# EAGLE design AST-WiFi-Shield (EAGLE 9.1.1)

## Sheet 1 of 2
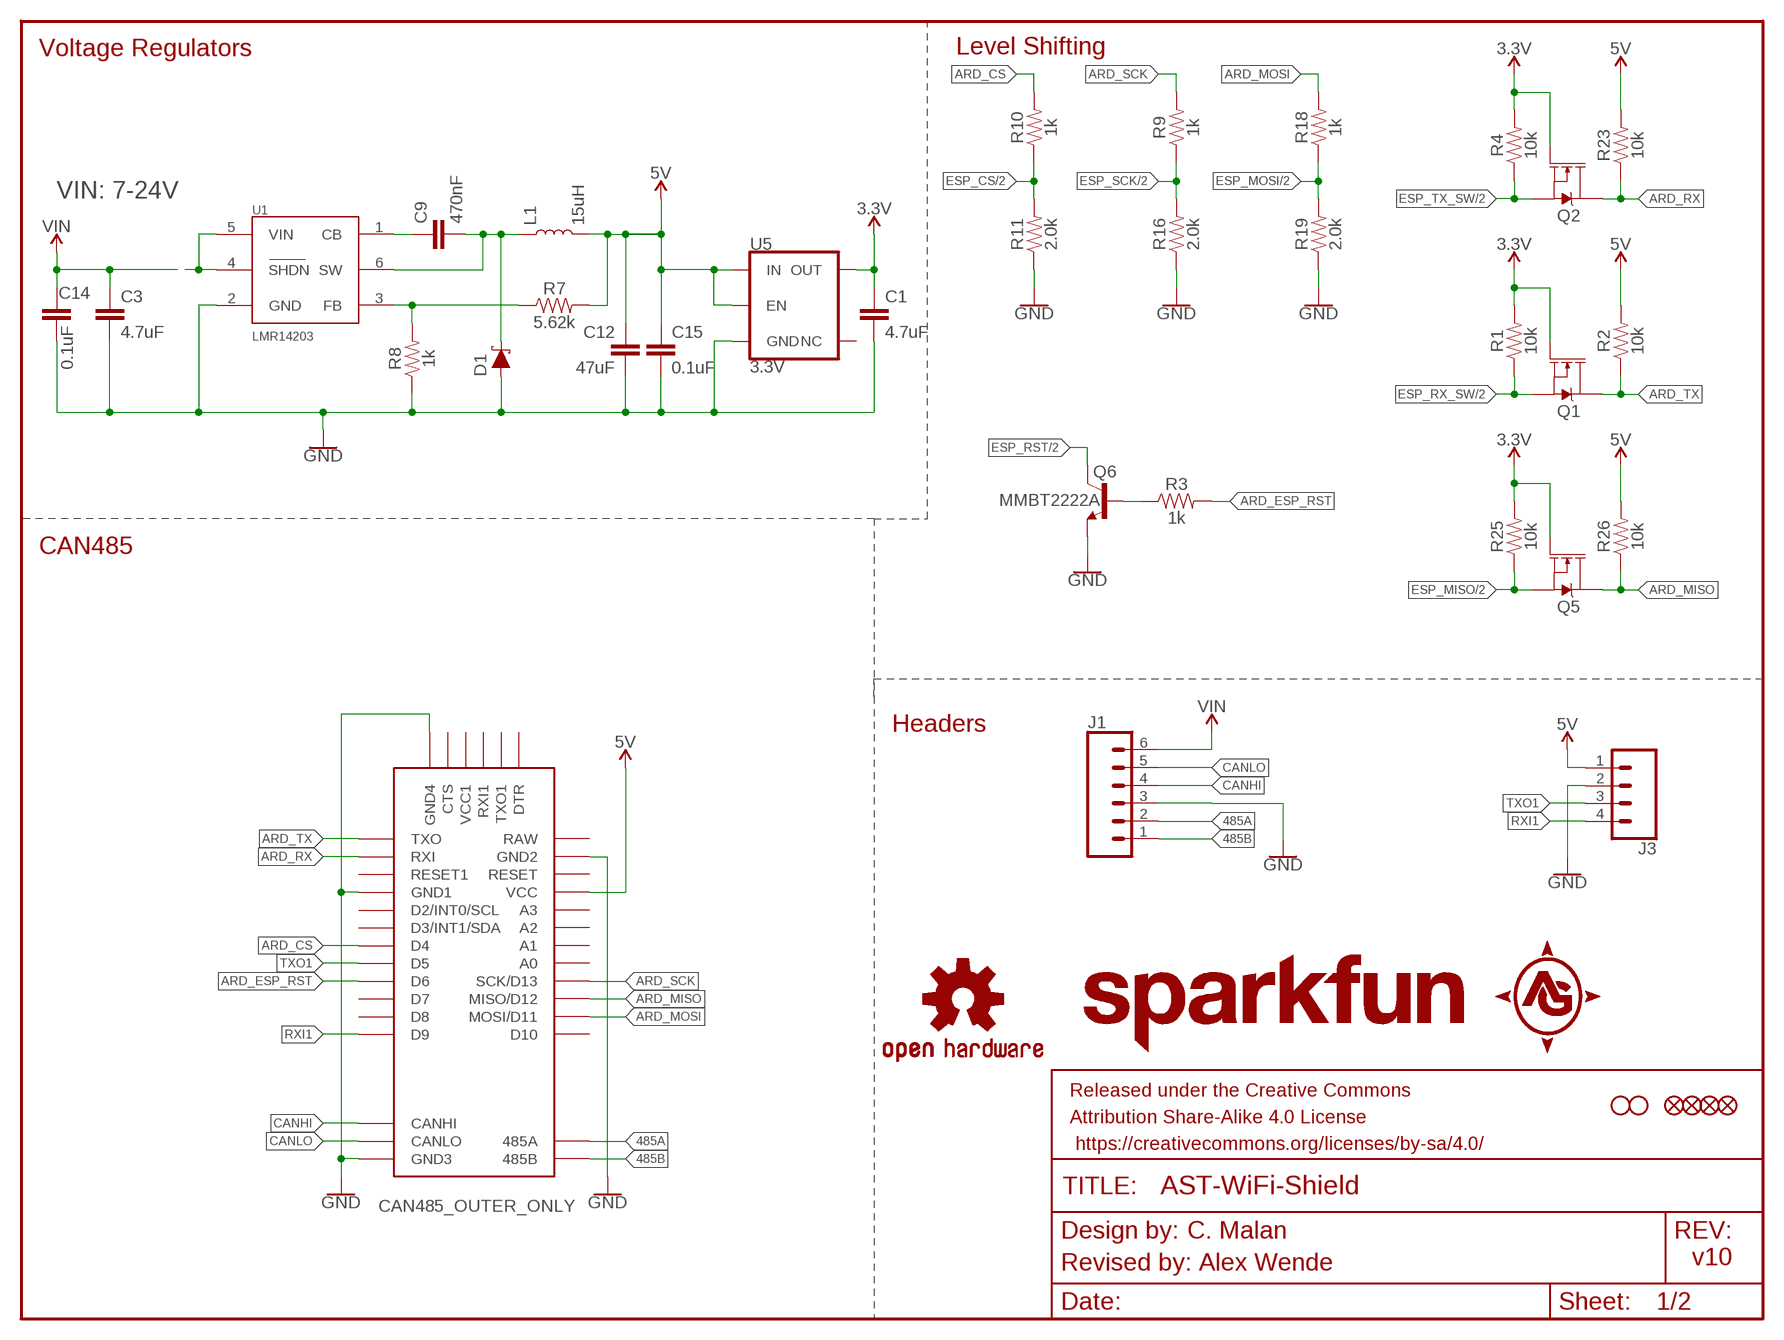
[diagram p0: schematic, sheet 1]

### Parts
C1  4.7uF  4.7UF-0603-6.3V-(10%)  [0603]
C3  4.7uF  4.7UF-0603-35V-(20%)  [0603]
C9  470nF  470NF-0603-10V-10%-X5R  [0603]
C12  47uF  47UF  [0805]
C14  0.1uF  0.1UF-0603-100V-10%  [0603]
C15  0.1uF  0.1UF-0603-25V-(+80/-20%)  [0603]
D1  DIODE-SCHOTTKY-MSS1P6-M3/89A  [DIODE-MICRO-SMP]
FD1  FIDUCIALUFIDUCIAL  [FIDUCIAL-MICRO]
FD2  FIDUCIALUFIDUCIAL  [FIDUCIAL-MICRO]
FD3  FIDUCIALUFIDUCIAL  [FIDUCIAL-MICRO]
FD4  FIDUCIALUFIDUCIAL  [FIDUCIAL-MICRO]
FRAME2  FRAME-LETTER  [CREATIVE_COMMONS]
H1  STAND-OFF  [STAND-OFF]
H2  STAND-OFF  [STAND-OFF]
J1  CONN_063.5MM-6  [SCREWTERMINAL-3.5MM-6]
J3  CONN_04LOCK  [1X04_LOCK]
L1  15uH  INDUCTOR-LHQ32-15UH  [INDUCTOR_LQH32]
LOGO1  OSHW-LOGOS  [OSHW-LOGO-S]
LOGO2  SFE_LOGO_NAME.2_INCH  [SFE_LOGO_NAME_.2]
Q1  220mA/50V/3.5Ω  MOSFET-NCH-BSS138  [SOT23-3]
Q2  220mA/50V/3.5Ω  MOSFET-NCH-BSS138  [SOT23-3]
Q5  220mA/50V/3.5Ω  MOSFET-NCH-BSS138  [SOT23-3]
Q6  MMBT2222A  TRANSISTOR_NPNMMBT2222A  [SOT23-3@1]
R1  10k  10KOHM-0603-1/10W-1%  [0603]
R2  10k  10KOHM-0603-1/10W-1%  [0603]
R3  1k  1KOHM-0603-1/10W-1%  [0603]
R4  10k  10KOHM-0603-1/10W-1%  [0603]
R7  5.62k  5.62KOHM-0603-1/10W-1%  [0603]
R8  1k  1KOHM-0603-1/10W-1%  [0603]
R9  1k  1KOHM-0603-1/10W-1%  [0603]
R10  1k  1KOHM-0603-1/10W-1%  [0603]
R11  2.0k  2.0KOHM-0603-1/10W-5%  [0603]
R16  2.0k  2.0KOHM-0603-1/10W-5%  [0603]
R18  1k  1KOHM-0603-1/10W-1%  [0603]
R19  2.0k  2.0KOHM-0603-1/10W-5%  [0603]
R23  10k  10KOHM-0603-1/10W-1%  [0603]
R25  10k  10KOHM-0603-1/10W-1%  [0603]
R26  10k  10KOHM-0603-1/10W-1%  [0603]
U1  LMR14203  [SOT23-6]
U5  3.3V  V_REG_AP2112K-3.3V  [SOT23-5]
U$2  CAN485_OUTER_ONLY  [CAN485_OUTER_ONLY]

### Nets
3.3V: C1.1 Q1.1(G) Q2.1(G) Q5.1(G) R1.2 R4.2 R25.2 U5.5(OUT) ; also sheet 2
5V: C12.1 C15.1 J3.1 L1.P$2 R2.2 R7.2 R23.2 R26.2 U5.1(IN) U5.3(EN) U$2.VCC
485A: J1.2 U$2.485A
485B: J1.1 U$2.485B
ARD_CS: R10.2 U$2.4(D4)
ARD_ESP_RST: R3.2 U$2.6(D6)
ARD_MISO: Q5.3(D) R26.1 U$2.12(MISO/D12)
ARD_MOSI: R18.2 U$2.11(MOSI/D11)
ARD_RX: Q2.3(D) R23.1 U$2.RXI
ARD_SCK: R9.2 U$2.13(SCK/D13)
ARD_TX: Q1.3(D) R2.1 U$2.TXO
CANHI: J1.4 U$2.CANHI
CANLO: J1.5 U$2.CANLO
ESP_CS: R10.1 R11.2 ; also sheet 2
ESP_MISO: Q5.2(S) R25.1 ; also sheet 2
ESP_MOSI: R18.1 R19.2 ; also sheet 2
ESP_RST: Q6.3(C) ; also sheet 2
ESP_RX_SW: Q1.2(S) R1.1 ; also sheet 2
ESP_SCK: R9.1 R16.2 ; also sheet 2
ESP_TX_SW: Q2.2(S) R4.1 ; also sheet 2
GND: C1.2 C3.2 C12.2 C14.2 C15.2 D1.A J1.3 J3.2 Q6.2(E) R8.1 R11.1 R16.1 R19.1 U1.2(GND) U5.2(GND) U$2.GND1 U$2.GND2 U$2.GND3 U$2.GND4 ; also sheet 2
N$1: C9.1 U1.1(CB)
N$8: R7.1 R8.2 U1.3(FB)
N$10: Q6.1(B) R3.1
RXI1: J3.4 U$2.9(D9)
TXO1: J3.3 U$2.5(D5)
VIN: C3.1 C14.1 J1.6 U1.4(SHDN) U1.5(VIN)
VSW: C9.2 D1.C L1.P$1 U1.6(SW)
Unconnected: U5.4(NC) U$2.2(D2/INT0/SCL) U$2.3(D3/INT1/SDA) U$2.7(D7) U$2.8(D8) U$2.10(D10) U$2.A0 U$2.A1 U$2.A2 U$2.A3 U$2.CTS U$2.DTR U$2.RAW U$2.RST1(RESET1) U$2.RST(RESET) U$2.RXI1 U$2.TXO1 U$2.VCC1

### Notes on the sheet
- Voltage Regulators | Level Shifting
- VIN: 7-24V
- CAN485
- Headers
- C. Malan
- Revised by: Alex Wende | v10

## Sheet 2 of 2
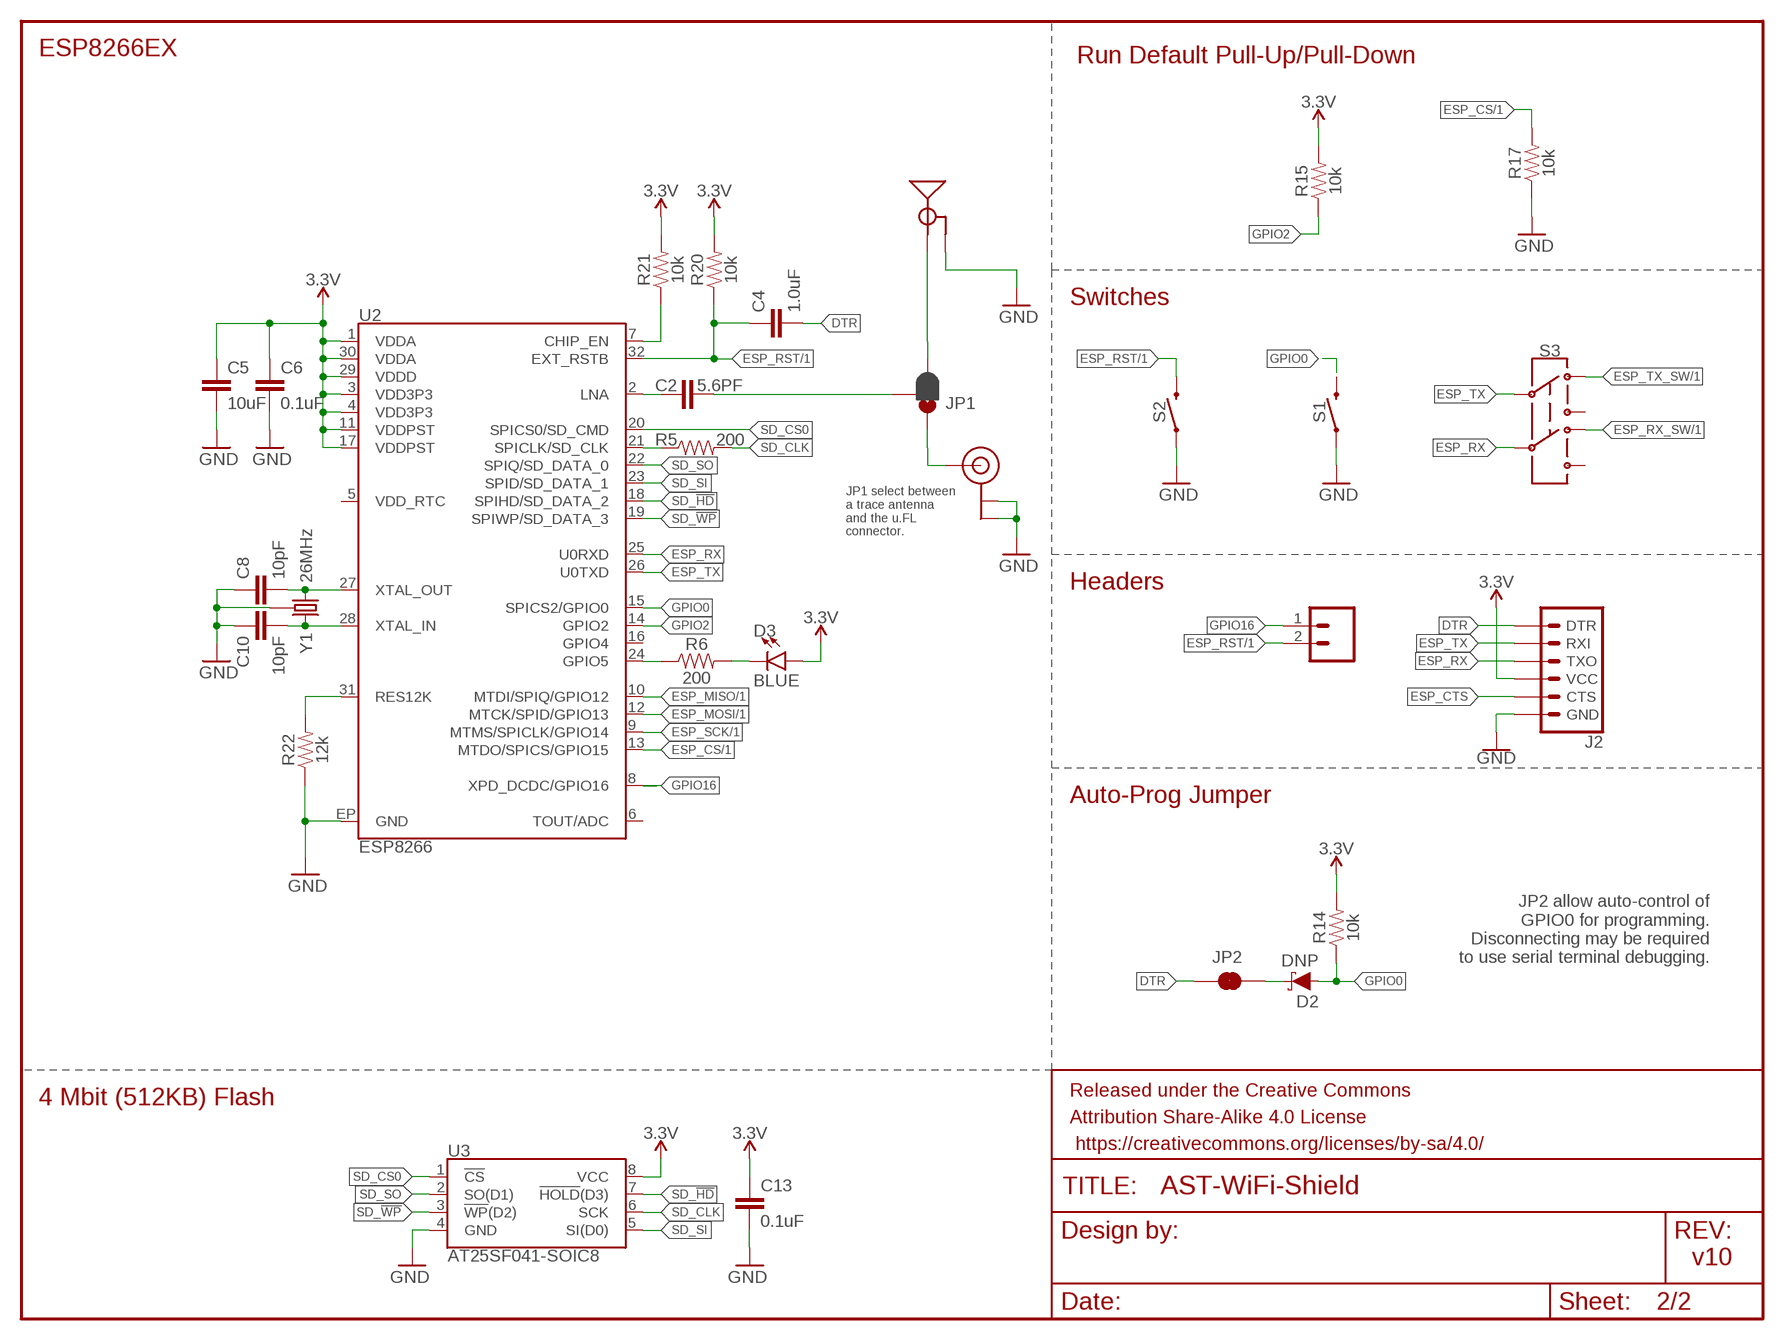
[diagram p1: schematic, sheet 2]

### Parts
C2  5.6PF  5.6PF-0603-50V-5%  [0603]
C4  1.0uF  1.0UF-0603-16V-10%  [0603]
C5  10uF  10UF-0603-6.3V-20%  [0603]
C6  0.1uF  0.1UF-0603-25V-(+80/-20%)  [0603]
C8  10pF  10PF-0603-50V-5%  [0603]
C10  10pF  10PF-0603-50V-5%  [0603]
C13  0.1uF  0.1UF-0603-25V-(+80/-20%)  [0603]
D2  DNP  DIODE-SCHOTTKY-BAT20J  [SOD-323]
D3  BLUE  LED-BLUE0603  [LED-0603]
E1  ANTENNATRACE  [TRACE_ANTENNA_2.4GHZ_25.7MM]
E2  U.FL  [U.FL]
FRAME3  FRAME-LETTERNO_PACKAGE  [DUMMY]
J2  6_PIN_SERIAL_TARGETLOCK  [1X06_LOCK]
JP1  JUMPER-SMT_3_1-NC_PASTE_NO-SILK  [SMT-JUMPER_3_1-NC_PASTE_NO-SILK]
JP2  JUMPER-SMT_2_NC_TRACE_NO-SILK  [SMT-JUMPER_2_NC_TRACE_NO-SILK]
R5  200  200OHM-0603-1/10W-1%  [0603]
R6  200  200OHM-0603-1/10W-1%  [0603]
R14  10k  10KOHM-0603-1/10W-1%  [0603]
R15  10k  10KOHM-0603-1/10W-1%  [0603]
R17  10k  10KOHM-0603-1/10W-1%  [0603]
R20  10k  10KOHM-0603-1/10W-1%  [0603]
R21  10k  10KOHM-0603-1/10W-1%  [0603]
R22  12k  12KOHM-0603-1/10W-1%  [0603]
S1  MOMENTARY-SWITCH-SPST-SMD-4.6X2.8MM  [TACTILE_SWITCH_SMD_4.6X2.8MM]
S2  MOMENTARY-SWITCH-SPST-SMD-4.6X2.8MM  [TACTILE_SWITCH_SMD_4.6X2.8MM]
S3  SWITCH-DPDT-SMD-JS202011JCQN  [SWITCH_DPDT_SMD_JS202011JCQN]
SJ2  SLEEP-PTH  CONN_021X02_NO_SILK  [1X02_NO_SILK]
U2  ESP8266  [QFN32]
U3  AT25SF041-SOIC8  [SO08]
Y1  26MHz  CRYSTAL-GROUNDED3.2X2.5  [CRYSTAL-SMD-3.2X2.5]

### Nets
3.3V: C5.1 C6.1 C13.1 D3.A J2.4(VCC) R14.2 R15.2 R20.2 R21.2 U2.1(VDDA) U2.3(VDD3P3) U2.4(VDD3P3) U2.11(VDDPST) U2.17(VDDPST) U2.29(VDDD) U2.30(VDDA) U3.8(VCC) ; also sheet 1
ANT: E2.FEED(SIGNAL) JP1.1
CHIP_EN: R21.1 U2.7(CHIP_EN)
DTR: C4.2 J2.1(DTR) JP2.1
ESP_CS: R17.2 U2.13(MTDO/SPICS/GPIO15) ; also sheet 1
ESP_CTS: J2.5(CTS)
ESP_MISO: U2.10(MTDI/SPIQ/GPIO12) ; also sheet 1
ESP_MOSI: U2.12(MTCK/SPID/GPIO13) ; also sheet 1
ESP_RST: C4.1 R20.1 S2.3 S2.4 SJ2.2 U2.32(EXT_RSTB) ; also sheet 1
ESP_RX: J2.3(TXO) S3.5 U2.25(U0RXD)
ESP_RX_SW: S3.6 ; also sheet 1
ESP_SCK: U2.9(MTMS/SPICLK/GPIO14) ; also sheet 1
ESP_TX: J2.2(RXI) S3.2 U2.26(U0TXD)
ESP_TX_SW: S3.1 ; also sheet 1
GND: C5.2 C6.2 C8.1 C10.1 C13.2 E1.GND E1.GND2(GND) E2.1(GND) E2.2(GND) J2.6(GND) R17.1 R22.1 S1.1 S1.2 S2.1 S2.2 U2.EP(GND) U3.4(GND) Y1.2(GND) Y1.4(GND) ; also sheet 1
GPIO0: D2.A R14.1 S1.3 S1.4 U2.15(SPICS2/GPIO0)
GPIO2: R15.1 U2.14(GPIO2)
GPIO5: R6.1 U2.24(GPIO5)
GPIO16: SJ2.1 U2.8(XPD_DCDC/GPIO16)
N$2: D2.C JP2.2
N$3: R22.2 U2.31(RES12K)
N$4: C10.2 U2.28(XTAL_IN) Y1.3
N$5: C8.2 U2.27(XTAL_OUT) Y1.1
N$6: C2.1 U2.2(LNA)
N$7: C2.2 JP1.2
N$9: D3.C R6.2
SD_!HD!: U2.18(SPIHD/SD_DATA_2) U3.7(!HOLD!(D3))
SD_!WP!: U2.19(SPIWP/SD_DATA_3) U3.3(!WP!(D2))
SD_CLK: R5.2 U3.6(SCK)
SD_CLK0: R5.1 U2.21(SPICLK/SD_CLK)
SD_CS0: U2.20(SPICS0/SD_CMD) U3.1(!CS!)
SD_SI: U2.23(SPID/SD_DATA_1) U3.5(SI(D0))
SD_SO: U2.22(SPIQ/SD_DATA_0) U3.2(SO(D1))
TRACE_ANT: E1.ANT(SIGNAL) JP1.3
Unconnected: S3.3 S3.4 U2.5(VDD_RTC) U2.6(TOUT/ADC) U2.16(GPIO4)

### Notes on the sheet
- ESP8266EX | Run Default Pull-Up/Pull-Down
- Switches
- JP1 select between
  a trace antenna
  and the u.FL 
  connector.
- Headers
- Auto-Prog Jumper
- JP2 allow auto-control of
  GPIO0 for programming.
  Disconnecting may be required
  to use serial terminal debugging.
- 4 Mbit (512KB) Flash
- v10

## Library data of the parts
C1 = SparkFun-Capacitors:4.7UF: 4.7µF ceramic capacitors A capacitor is a passive two-terminal electrical component used to store electrical energy temporarily in an electric field.; PROD_ID: CAP-08280
C2 = SparkFun-Capacitors:5.6PF: 5.6pF ceramic capacitors A capacitor is a passive two-terminal electrical component used to store electrical energy temporarily in an electric field.; PROD_ID: CAP-12456
C3 = SparkFun-Capacitors:4.7UF: 4.7µF ceramic capacitors A capacitor is a passive two-terminal electrical component used to store electrical energy temporarily in an electric field.; PROD_ID: CAP-14106
C4 = SparkFun-Capacitors:1.0UF: 1µF ceramic capacitors A capacitor is a passive two-terminal electrical component used to store electrical energy temporarily in an electric field.; PROD_ID: CAP-00868
C5 = SparkFun-Capacitors:10UF: 10.0µF ceramic capacitors A capacitor is a passive two-terminal electrical component used to store electrical energy temporarily in an electric field.; PROD_ID: CAP-11015
C6 C13 C15 = SparkFun-Capacitors:0.1UF: 0.1µF ceramic capacitors A capacitor is a passive two-terminal electrical component used to store electrical energy temporarily in an electric field.; PROD_ID: CAP-00810
C8 C10 = SparkFun-Capacitors:10PF: 10pF ceramic capacitors A capacitor is a passive two-terminal electrical component used to store electrical energy temporarily in an electric field.; PROD_ID: CAP-11812
C9 = SparkFun-Capacitors:470NF: 0.47uF/470nF ceramic capacitors A capacitor is a passive two-terminal electrical component used to store electrical energy temporarily in an electric field.; PROD_ID: CAP-13216
C12 = SparkFun-Capacitors:47UF; PROD_ID: CAP-13854; VALUE: 47uF/6.3V
C14 = SparkFun-Capacitors:0.1UF: 0.1µF ceramic capacitors A capacitor is a passive two-terminal electrical component used to store electrical energy temporarily in an electric field.; PROD_ID: CAP-08390
D1 = SparkFun-DiscreteSemi:DIODE-SCHOTTKY: Schottky diode A Schottky diode is a semiconductor diode which has a low forward voltage drop and a very fast switching action.; PROD_ID: DIO-13919; VALUE: 1A/60V/520mV
D2 = SparkFun-DiscreteSemi:DIODE-SCHOTTKY: Schottky diode A Schottky diode is a semiconductor diode which has a low forward voltage drop and a very fast switching action.; PROD_ID: DIO-11623; VALUE: 1A/23V/620mV
D3 = SparkFun-LED:LED-BLUE: Blue SMD LED Used in manufacturing of various products at SparkFun Packages: 0603 - SMD 0603 package [Product Link] <http://www.digikey.com/product-detail/en/SMLE12BC7TT86/511-1589-2-ND/1641808> 1206 - SMD1206 package [Product Link] <http://www.digikey.com/product-detail/en/lite-on-inc/LTST-C150TBKT/160-1643-1-ND/573584> SparkFun Products: ESP8266 Thing-Dev Board <https://www.sparkfun.com/products/13711> RedBoard <https://www.sparkfun.com/products/12757>; PROD_ID: DIO-08575
E1 = SparkFun-RF:ANTENNA: Chip antenna Chip antenna with ground or secondary connection. Common with larger metal RF connectors.
E2 = SparkFun-Connectors:U.FL: SMD Antenna Connector - U.FL 2mm height, 3.0mm x 3.0mm receptacle size. SparkFun Products: SparkFun WiFi Shield - ESP8266 <https://www.sparkfun.com/products/13287> SparkFun ESP8266 Thing <https://www.sparkfun.com/products/13231> SparkFun MiniGen - Pro Mini Signal Generator Shield <https://www.sparkfun.com/products/11420>; PROD_ID: CONN-09193; SF_ID: WRL-09144
FD1-FD4 = SparkFun-Aesthetics:FIDUCIAL: Fiducial Alignment Points Point-of-reference for pick-and-place machines and other optical instruments.
FRAME2 = SparkFun-Aesthetics:FRAME-LETTER: Schematic Frame - Letter Standard 8.5x11 US Letter frame
FRAME3 = SparkFun-Aesthetics:FRAME-LETTER: Schematic Frame - Letter Standard 8.5x11 US Letter frame; DESIGNER: Nobody; VERSION: v01
H1 H2 = SparkFun-Hardware:STAND-OFF: Stand Off Drill holes for mechanically mounting via screws, standoffs, etc. Note: Use the keepout ring to avoid running the screw head into surrounding components. Variant Overviews STAND-OFF - Mechanical footprint for a #4 phillips button head screw. STAND-OFF-TIGHT - Mechanical footprint for a #4 phillips button head screw, Example SparkFun Products Screw - Phillips Head (1/4", 4-40, 10 pack) <https://www.sparkfun.com/products/10453> (PRT-10453) Screw - Phillips Head (1/2", 4-40, 10 pack) <https://www.sparkfun.com/products/10452> (PRT-10452) Screw - Phillips Head (3/4", 4-40, 10 pack) <https://www.sparkfun.com/products/10451> (PRT-10451) Screw - Phillips Head (1", 4-40, 10 pack) <https://www.sparkfun.com/products/10450> (PRT-10450)
J1 = SparkFun-Connectors:CONN_06: Multi connection point. Often used as Generic Header-pin footprint for 0.1 inch spaced/style header connections On any of the 0.1 inch spaced packages, you can populate with these: Break Away Headers - Straight <https://www.sparkfun.com/products/116> (PRT-00116) Break Away Male Headers - Right Angle <https://www.sparkfun.com/products/553> (PRT-00553) Female Headers <https://www.sparkfun.com/products/115> (PRT-00115) Break Away Headers - Machine Pin <https://www.sparkfun.com/products/117> (PRT-00117) Break Away Female Headers - Swiss Machine Pin <https://www.sparkfun.com/products/743> (PRT-00743) Arduino Stackable Header - 6 Pin <https://www.sparkfun.com/products/9280> (PRT-09280) For SCREWTERMINALS and SPRING TERMINALS visit here: Screw Terimnals on SparkFun.com <https://www.sparkfun.com/search/results?term=Screw+Terminals> (5mm/3.5mm/2.54mm spacing) This device is also useful as a general connection point to wire up your design to another part of your project. Our various solder wires solder well into these plated through hole pads. Hook-Up Wire - Assortment (Stranded, 22 AWG) <https://www.sparkfun.com/products/11375> (PRT-11375) Hook-Up Wire - Assortment (Solid Core, 22 AWG) <https://www.sparkfun.com/products/11367> (PRT-11367) View the entire wire category on our website here <https://www.sparkfun.com/categories/141>
J2 = SparkFun-Connectors:6_PIN_SERIAL_TARGET: 6-pin header connection for use with the "FTDI BASIC" pinout - TARGET SIDE. Also known as "Arduino Serial Program Header". It is used to mate with our FTDI Basic serial programmers using the Arduino IDE. Note, this device has "TARGET" in the name. It is intended to be used on a design that contains a target micro-controller that you wish to program. The "sister" device, named "CABLE" is inteneded to be used on a design that usually lives on the end of your USB cable and prvides the converter chip (FTDI232 or FTDI231x) to commnicate serial RX/TX. You can populate with some of these: Break Away Headers - Straight <https://www.sparkfun.com/products/116> (PRT-00116) For reference (or to suit your programming needs) check out these designs: SparkFun FTDI Basic Breakout - 5V <https://www.sparkfun.com/products/9716> (DEV-09716) SparkFun FTDI Basic Breakout - 3.3V <https://www.sparkfun.com/products/9873> (DEV-09873) SparkFun FTDI SmartBasic <https://www.sparkfun.com/products/12935> (DEV-12935) SparkFun Beefy 3 - FTDI Basic Breakout <https://www.sparkfun.com/products/13746> (DEV-13746); PROD_ID: CONN-09698
J3 = SparkFun-Connectors:CONN_04: Multi connection point. Often used as Generic Header-pin footprint for 0.1 inch spaced/style header connections On any of the 0.1 inch spaced packages, you can populate with these: Break Away Headers - Straight <https://www.sparkfun.com/products/116> (PRT-00116) Break Away Male Headers - Right Angle <https://www.sparkfun.com/products/553> (PRT-00553) Female Headers <https://www.sparkfun.com/products/115> (PRT-00115) Break Away Headers - Machine Pin <https://www.sparkfun.com/products/117> (PRT-00117) Break Away Female Headers - Swiss Machine Pin <https://www.sparkfun.com/products/743> (PRT-00743) For SCREWTERMINALS and SPRING TERMINALS visit here: Screw Terimnals on SparkFun.com <https://www.sparkfun.com/search/results?term=Screw+Terminals> (5mm/3.5mm/2.54mm spacing) This device is also useful as a general connection point to wire up your design to another part of your project. Our various solder wires solder well into these plated through hole pads. Hook-Up Wire - Assortment (Stranded, 22 AWG) <https://www.sparkfun.com/products/11375> (PRT-11375) Hook-Up Wire - Assortment (Solid Core, 22 AWG) <https://www.sparkfun.com/products/11367> (PRT-11367) View the entire wire category on our website here <https://www.sparkfun.com/categories/141> Special notes: Molex polarized connector foot print use with SKU : PRT-08231 with associated crimp pins and housings. 1MM SMD Version SKU: PRT-10208; PROD_ID: CONN-09696
JP1 = SparkFun-Jumpers:JUMPER-SMT_3_1-NC_PASTE: Normally closed solder jumper (1 of 2 connections) This jumper has an aperture in the stencil to allow solder paste to bridge one of the two connections. One connection is normally closed (NC), while the other is normally open (NO). Wick off the solder to open the connection. Reapply solder to reclose the connection. Apply solder to the other side instead to change the current path.
JP2 = SparkFun-Jumpers:JUMPER-SMT_2_NC_TRACE: Normally closed trace jumper This jumper has a trace between two pads so it's normally closed (NC). Use a razor knife to open the connection. For best results follow the IPC guidelines for cutting traces: Cutout at least 0.063 mm (0.005 in). Remove all loose material to clean up the cut area. Seal the cut with an approved epoxy. Reapply solder to reclose the connection.
L1 = SparkFun-Coils:INDUCTOR: Inductors Resist changes in electrical current. Basically a coil of wire. SparkFun Products: SparkFun Load Cell Amplifier - HX711 <https://www.sparkfun.com/products/13879> IOIO-OTG - V2.2 <https://www.sparkfun.com/products/13613>; PROD_ID: NDUC-14107
LOGO1 = SparkFun-Aesthetics:OSHW-LOGO: Open-Source Hardware (OSHW) Logo This logo indicates the piece of hardware it is found on incorporates a OSHW license and/or adheres to the definition of open source hardware found here: http://freedomdefined.org/OSHW
LOGO2 = SparkFun-Aesthetics:SFE_LOGO_NAME: SparkFun Font Logo This is the SparkFun name logo. The logo on the schematic will always be the same size; the package variant is the height of the flame part of the logo (or the height the flame would be, if it were drawn). Default layer for the logo on the board is tSilk.
Q1 Q2 Q5 = SparkFun-DiscreteSemi:MOSFET-NCH: N-channel MOSFETs Voltage controlled devices that allow control of high current outputs. SparkFun Products: SparkFun OpenScale <https://www.sparkfun.com/products/13261> SparkFun Digital Sandbox <https://www.sparkfun.com/products/12651> SparkFun Monster Moto Shield <https://www.sparkfun.com/products/10182> SparkFun MOSFET Power Controller <https://www.sparkfun.com/products/11214>; PROD_ID: TRANS-00830
Q6 = SparkFun-DiscreteSemi:TRANSISTOR_NPN: Generic NPN BJT MMBT2222A - TRANS-08049 (SOT-23, 1A 40V) MPSA42 - TRANS-09116 (SOT-23, 500mA 300V) MMBT5088LT1G - TRANS-11160 (SOT-23, 50 mA 30V) BC547 - COM-08928 <http://www.sparkfun.com/products/8928> (TO-92 45V 100mA) (1.Collector 2.Base 3.Emitter) 2N3904 - COM-00521 <http://www.sparkfun.com/products/521> (TO-92 40V 200mA) (1.Emitter 2.Base 3.Collector) P2N2222A - COM-12852 <http://www.sparkfun.com/products/12852> (TO-92 40V 600mA) (1.Collector 2.Base 3.Emitter); PROD_ID: TRANS-08049
R1 R2 R4 R14 R15 R17 R20 R21 R23 R25 R26 = SparkFun-Resistors:10KOHM: 10kΩ resistor A resistor is a passive two-terminal electrical component that implements electrical resistance as a circuit element. Resistors act to reduce current flow, and, at the same time, act to lower voltage levels within circuits. - Wikipedia; PROD_ID: RES-00824
R3 R8-R10 R18 = SparkFun-Resistors:1KOHM: 1kΩ resistor A resistor is a passive two-terminal electrical component that implements electrical resistance as a circuit element. Resistors act to reduce current flow, and, at the same time, act to lower voltage levels within circuits. - Wikipedia; PROD_ID: RES-07856
R5 R6 = SparkFun-Resistors:200OHM: 200Ω resistor A resistor is a passive two-terminal electrical component that implements electrical resistance as a circuit element. Resistors act to reduce current flow, and, at the same time, act to lower voltage levels within circuits. - Wikipedia; PROD_ID: RES-08220
R7 = SparkFun-Resistors:5.62KOHM: 5.62kΩ resistor A resistor is a passive two-terminal electrical component that implements electrical resistance as a circuit element. Resistors act to reduce current flow, and, at the same time, act to lower voltage levels within circuits. - Wikipedia; PROD_ID: RES-09823
R11 R16 R19 = SparkFun-Resistors:2.0KOHM: 2kΩ resistor A resistor is a passive two-terminal electrical component that implements electrical resistance as a circuit element. Resistors act to reduce current flow, and, at the same time, act to lower voltage levels within circuits. - Wikipedia; PROD_ID: RES-08296
R22 = SparkFun-Resistors:12KOHM: 12kΩ resistor A resistor is a passive two-terminal electrical component that implements electrical resistance as a circuit element. Resistors act to reduce current flow, and, at the same time, act to lower voltage levels within circuits. - Wikipedia; PROD_ID: RES-10327
S1 S2 = SparkFun-Switches:MOMENTARY-SWITCH-SPST: Momentary Switch (Pushbutton) - SPST Normally-open (NO) SPST momentary switches (buttons, pushbuttons). Variants PTH-12MM - 12mm square, through-hole Momentary Pushbutton Switch - 12mm Square <https://www.sparkfun.com/products/9190> (COM-09190) PTH-6.0MM, PTH-6.0MM-KIT - 6.0mm square, through-hole Mini Pushbutton Switch <https://www.sparkfun.com/products/97> (COM-00097) KIT package intended for soldering kit's - only one side of pads' copper is exposed. PTH-RIGHT-ANGLE-KIT - Right-angle, through-hole Right Angle Tactile Button <https://www.sparkfun.com/products/10791> - Used on SparkFun BigTime Watch Kit <https://www.sparkfun.com/products/11734> SMD-12MM - 12mm square, surface-mount Tactile Button - SMD (12mm) <https://www.sparkfun.com/products/12993> (COM-12993) Used on SparkFun PicoBoard <https://www.sparkfun.com/products/11888> SMD-4.5MM - 4.5mm Square Trackball Switch Used on SparkFun Blackberry Trackballer Breakout <https://www.sparkfun.com/products/13169> SMD-4.6MMX2.8MM - 4.60mm x 2.80mm, surface mount Used on SparkFun SAMD21 Mini Breakout <https://www.sparkfun.com/products/13664> SMD-5.2MM, SMD-5.2-REDUNDANT - 5.2mm square, surface-mount Mini Pushbutton Switch - SMD <https://www.sparkfun.com/products/8720> (COM-08720) Used on Arduino Pro Mini <https://www.sparkfun.com/products/11114> REDUNDANT package connects both switch circuits together SMD-6.0X3.5MM - 6.0 x 3.5mm, surface mount Momentary Reset Switch SMD <https://www.sparkfun.com/products/8229> (COM-08229) SMD-6.2MM-TALL - 6.2mm square, surface mount Tactile Button - SMD (6mm) <https://www.sparkfun.com/products/12992> Used on SparkFun Digital Sandbox <https://www.sparkfun.com/products/12651> SMD-RIGHT-ANGLE - Right-angle, surface mount Used on SparkFun Block for Intel® Edison - Arduino <https://www.sparkfun.com/products/13036>; PROD_ID: SWCH-13065
S3 = SparkFun-Switches:SWITCH-DPDT: Double-Pole, Double-Throw (DPDT) Switch Double-pole, double-throw switches. Variant Overview PTH-GPI-152-3013 Used on SparkFun Geiger Counter <https://www.sparkfun.com/products/11345> SMD-AY0202 Surface Mount DPDT Switch <https://www.sparkfun.com/products/597> (COM-00597) Used on e.g. LilyPad Arduino USB - ATmega32U4 Board <https://www.sparkfun.com/products/12049>; PROD_ID: SWCH-14133
SJ2 = SparkFun-Connectors:CONN_02: Multi connection point. Often used as Generic Header-pin footprint for 0.1 inch spaced/style header connections On any of the 0.1 inch spaced packages, you can populate with these: Break Away Headers - Straight <https://www.sparkfun.com/products/116> (PRT-00116) Break Away Male Headers - Right Angle <https://www.sparkfun.com/products/553> (PRT-00553) Female Headers <https://www.sparkfun.com/products/115> (PRT-00115) Break Away Headers - Machine Pin <https://www.sparkfun.com/products/117> (PRT-00117) Break Away Female Headers - Swiss Machine Pin <https://www.sparkfun.com/products/743> (PRT-00743) For SCREWTERMINALS and SPRING TERMINALS visit here: Screw Terimnals on SparkFun.com <https://www.sparkfun.com/search/results?term=Screw+Terminals> (5mm/3.5mm/2.54mm spacing) This device is also useful as a general connection point to wire up your design to another part of your project. Our various solder wires solder well into these plated through hole pads. Hook-Up Wire - Assortment (Stranded, 22 AWG) <https://www.sparkfun.com/products/11375> (PRT-11375) Hook-Up Wire - Assortment (Solid Core, 22 AWG) <https://www.sparkfun.com/products/11367> (PRT-11367) View the entire wire category on our website here <https://www.sparkfun.com/categories/141> Special notes: Molex polarized connector foot print use with: PRT-08233 with associated crimp pins and housings. 2.54_SCREWTERM for use with PRT-10571. 3.5mm Screw Terminal footprints for PRT-08084 5mm Screw Terminal footprints for use with PRT-08432
U1 = SparkFun-IC-Power:LMR14203; PROD_ID: IC-13918
U2 = esp8266-development-board:ESP8266: Espressif ESP8266 WiFi Smart Connectivity Platform.; PROD_ID: IC-12452
U3 = esp8266-development-board:AT25SF041: SPI Serial Flash Memory with Dual/Quad-IO Support Example: Adesto Technologies AT25SF041-SSHD-T (1265-1131-1-ND) <http://www.digikey.com/product-detail/en/AT25SF041-SSHD-T/1265-1131-1-ND/4824165>; PROD_ID: IC-12455
U5 = SparkFun-IC-Power:V_REG_AP2112: AP2112 - 600mA CMOS LDO Regulator w/ Enable The AP2112 is CMOS process low dropout linear regulator with enable function, the regulator delivers a guaranteed 600mA (min.) continuous load current. Features Output Voltage Accuracy: ±1.5% Output Current: 600mA (Min.) Foldback Short Current Protection: 50mA Enable Function to Turn ON/OFF VOUT Low Dropout Voltage (3.3V): 250mV (Typ.) @IOUT=600mA Excellent Load Regulation: 0.2%/A (Typ.) Excellent Line Regulation: 0.02%/V (Typ.) Low Quiescent Current: 55μA (Typ.) Low Standby Current: 0.01μA (Typ.) Low Output Noise: 50μVRMS PSRR: 100Hz -65dB, 1kHz -65dB OTSD Protection Stable with 1.0μF Flexible Cap: Ceramic, Tantalum and Aluminum Electrolytic Operation Temperature Range: -40°C to 85°C ESD: MM 400V, HBM 4000V; PROD_ID: VREG-12457
U$2 = SparkFun-Boards:CAN485_OUTER_ONLY
Y1 = things:CRYSTAL-GROUNDED; PROD_ID: XTAL-12454

## Net classes
0 default: width 0.152 mm
1 vcc: width 0.254 mm

## Board
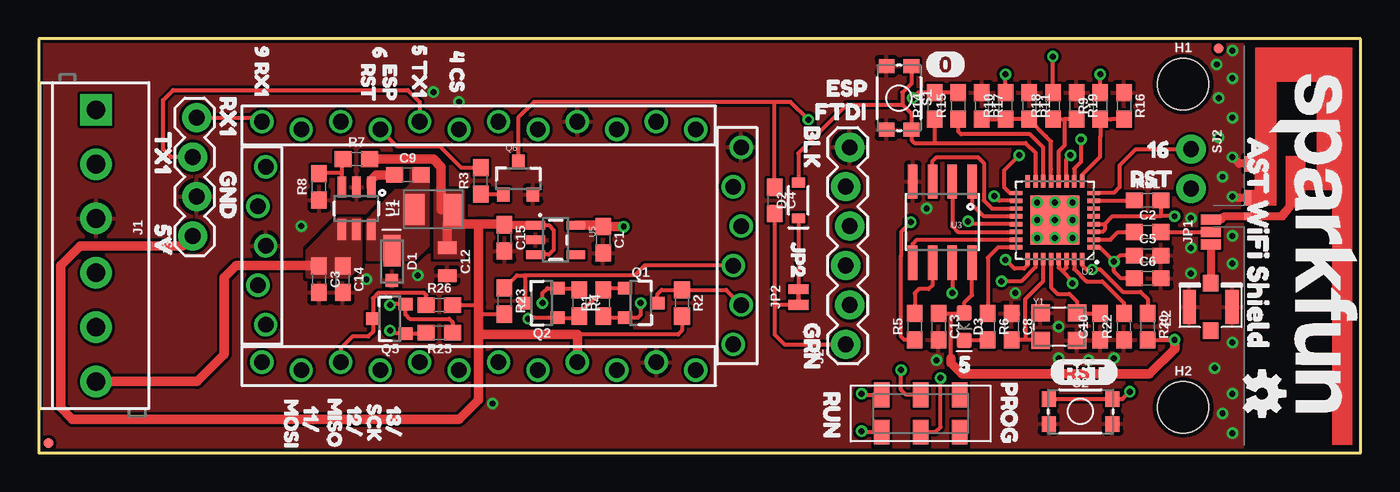
[diagram p2: board, top side]
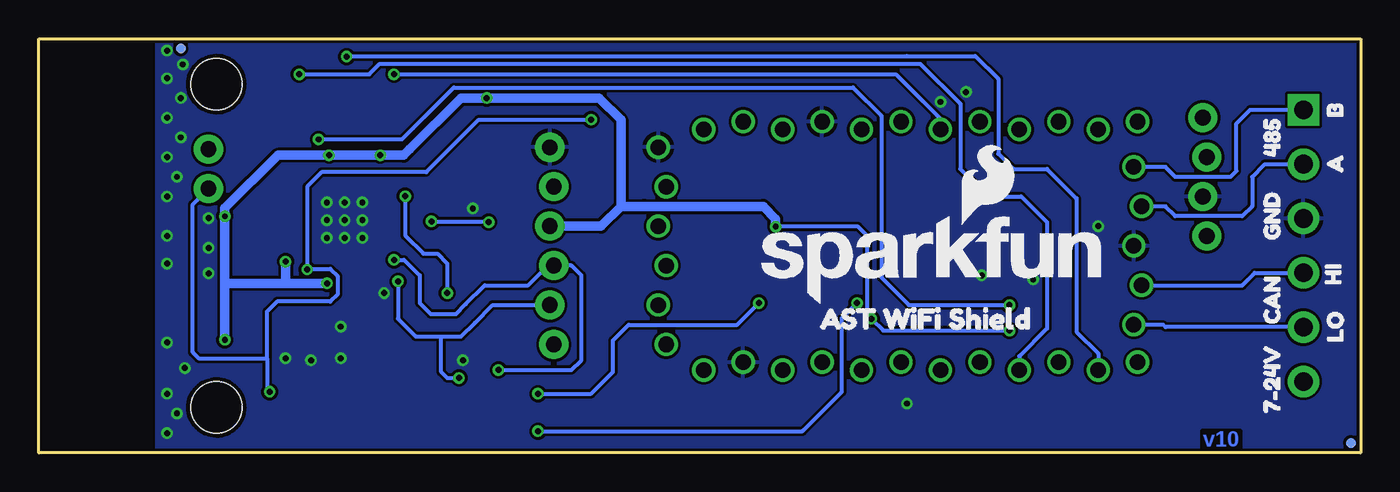
[diagram p3: board, bottom side, seen from below]

Size 85.09 x 26.67 mm. Coordinates in mm from the lower left corner, seen from the top.
Outline: 0,0 85.09,0 85.09,26.67 0,26.67 0,0
Copper layers (1*16): Top 0.035mm / dielectric 1.5mm / Bottom 0.035mm
Design rules "SparkFun-2-layer-TIGHT": minimum track width 7mil, minimum drill 15mil, track to track 7mil, track to pad 7mil, pad to pad 7mil, via to via 7mil, smd to smd 7mil, copper to edge 7mil, drill to drill 7mil, minimum pad ring 7mil, minimum via ring 7mil, stop-mask expansion 4mil, vias tented up to drill 25mil, thermal gap 10mil
tRestrict: 4 lines

### Footprints (pad centres in the part's own frame; a part is rotated, then mirrored left to right if it is on the bottom)
0603 = smd 1.1 x 1: 1 -0.85,0; 2 0.85,0
0805 = smd 0.8 x 1.2: 1 -0.9,0; 2 0.9,0
DIODE-MICRO-SMP = smd 0.813 x 0.813: A 1.219,0 | smd 2.007 x 1.102: C -0.699,0
SOD-323 = smd 0.63 x 0.83: A 1.15,0; C -1.15,0
LED-0603 = smd 1 x 1: A -0.877,0; C 0.877,0
TRACE_ANTENNA_2.4GHZ_25.7MM = smd 0.46 x 0.46: ANT 0,0.23 | smd 1 x 0.46: GND -1.18,0.23; GND2 -3.38,0.23
U.FL = smd 2.2 x 0.85: 1 0,1.375; 2 0,-1.375 | smd 1.05 x 1: FEED 1.525,0; NC -1.525,0
FIDUCIAL-MICRO = smd 0.635 x 0.635: 1 0,0
STAND-OFF = hole 3.302: 0,0
SCREWTERMINAL-3.5MM-6 = drill 1.2 pad 2.032 square: 1 0,0 | drill 1.2 pad 2.032: 2 3.5,0; 3 7,0; 4 10.5,0; 5 14,0; 6 17.5,0
1X06_LOCK = drill 1.016 pad 1.88: 1 0,0; 2 2.54,-0.254; 3 5.08,0; 4 7.62,-0.254; 5 10.16,0; 6 12.7,-0.254
1X04_LOCK = drill 1.016 pad 1.88: 1 0,0.127; 2 2.54,-0.127; 3 5.08,0.127; 4 7.62,-0.127
SMT-JUMPER_3_1-NC_PASTE_NO-SILK = smd 0.635 x 1.27: 1 -0.813,0; 2 0,0; 3 0.813,0
SMT-JUMPER_2_NC_TRACE_NO-SILK = smd 0.635 x 1.27: 1 -0.508,0; 2 0.508,0
INDUCTOR_LQH32 = smd 2 x 1.25: P$1 -0.07,1.205; P$2 -0.07,-1.295
SOT23-3 = smd 0.8 x 0.9: 1 -0.95,-1; 2 0.95,-1; 3 0,1.1
SOT23-3@1 = smd 0.8 x 0.9: 1 -0.95,-1; 2 0.95,-1; 3 0,1.1
TACTILE_SWITCH_SMD_4.6X2.8MM = smd 0.9 x 1: 1 -2.05,-0.8; 2 2.05,-0.8; 3 2.05,0.8; 4 -2.05,0.8
SWITCH_DPDT_SMD_JS202011JCQN = smd 1 x 1.6: 1 -2.5,-1.2; 2 0,-1.2; 3 2.5,-1.2; 4 2.5,1.2; 5 0,1.2; 6 -2.5,1.2
1X02_NO_SILK = drill 1.016 pad 1.88: 1 0,0; 2 2.54,0
SOT23-6 = smd 0.55 x 1.35: 1 -0.95,-1.375; 2 0,-1.375; 3 0.95,-1.375; 4 0.95,1.375; 5 0,1.375; 6 -0.95,1.375
QFN32 = smd 0.8 x 0.285: 1 -2.5,1.75; 2 -2.5,1.25; 3 -2.5,0.75; 4 -2.5,0.25; 5 -2.5,-0.25; 6 -2.5,-0.75; 7 -2.5,-1.25; 8 -2.5,-1.75; 17 2.5,-1.75; 18 2.5,-1.25; 19 2.5,-0.75; 20 2.5,-0.25; 21 2.5,0.25; 22 2.5,0.75; 23 2.5,1.25; 24 2.5,1.75 | smd 0.285 x 0.8: 9 -1.75,-2.5; 10 -1.25,-2.5; 11 -0.75,-2.5; 12 -0.25,-2.5; 13 0.25,-2.5; 14 0.75,-2.5; 15 1.25,-2.5; 16 1.75,-2.5; 25 1.75,2.5; 26 1.25,2.5; 27 0.75,2.5; 28 0.25,2.5; 29 -0.25,2.5; 30 -0.75,2.5; 31 -1.25,2.5; 32 -1.75,2.5 | smd 3.15 x 3.15: EP 0,0
SO08 = smd 0.61 x 2.21: 1 -1.905,-2.616; 2 -0.635,-2.616; 3 0.635,-2.616; 4 1.905,-2.616; 5 1.905,2.616; 6 0.635,2.616; 7 -0.635,2.616; 8 -1.905,2.616
SOT23-5 = smd 0.55 x 1.2: 1 -0.95,-1.3; 2 0,-1.3; 3 0.95,-1.3; 4 0.95,1.3; 5 -0.95,1.3
CAN485_OUTER_ONLY = drill 1: 2 -7.493,2.54; 3 -8.001,0; 4 -7.493,-2.54; 5 -8.001,-5.08; 6 -7.493,-7.62; 7 -8.001,-10.16; 8 -7.493,-12.7; 9 -8.001,-15.24; 10 7.493,-15.24; 11 8.001,-12.7; 12 7.493,-10.16; 13 8.001,-7.62; 485A -2.54,-15.494; 485B -5.08,-14.986; A0 7.493,-5.08; A1 8.001,-2.54; A2 7.493,0; A3 8.001,2.54; CANHI 2.54,-15.494; CANLO 5.08,-14.986; CTS -3.81,15.113; DTR 6.35,15.113; GND1 -8.001,5.08; GND2 7.493,10.16; GND3 0,-14.986; GND4 -6.35,15.621; RAW 8.001,12.7; RST 8.001,7.62; RST1 -7.493,7.62; RXI 1.27,15.113; RXI1 -8.001,10.16; TXO 3.81,15.621; TXO1 -7.493,12.7; VCC 7.493,5.08; VCC1 -1.27,15.621
CRYSTAL-SMD-3.2X2.5 = smd 1.2 x 1.1: 1 -1.175,-0.875; 2 1.175,-0.875; 3 1.175,0.875; 4 -1.175,0.875

### Placement (x,y rotation side)
C1  36.32,13.72 270 top
C2  71.37,14.22 0 top
C3  18.03,11.18 270 top
C4  47.37,16.26 270 top
C5  71.37,12.7 0 top
C6  71.37,11.24 0 top
C8  62.61,8.13 270 top
C9  23.75,17.91 0 top
C10  68.33,8.13 90 top
C12  26.29,12.32 270 top
C13  57.91,8.13 270 top
C14  19.56,11.18 270 top
C15  29.97,13.84 270 top
D1  22.73,12.32 270 top
D2  48.9,16.26 90 top
D3  59.56,8.13 270 top
E1  77.6,15.24 270 top
E2  75.44,9.4 90 top
FD1  0.64,0.64 0 top
FD2  75.95,26.04 0 top
FD3  0.64,0.64 0 bottom
FD4  75.95,26.04 0 bottom
FRAME2  13.97,-24.13 0 top  (outside the outline)
FRAME3  13.97,-29.21 0 top  (outside the outline)
H1  73.66,23.75 0 top
H2  73.66,2.92 0 top
J1  3.68,22.1 270 top
J2  51.94,6.99 90 top
J3  10.03,13.97 90 top
JP1  75.44,14.22 90 top
JP2  48.9,10.03 90 top
L1  25.4,15.75 90 top
LOGO1  78.74,3.81 270 top
LOGO2  79.25,24.38 270 top
Q1  38.73,9.65 270 top
Q2  32.38,9.65 90 top
Q5  22.61,8.64 90 top
Q6  30.86,17.65 0 top
R1  36.32,9.65 90 top
R2  41.4,9.65 270 top
R3  28.45,17.53 90 top
R4  34.8,9.65 270 top
R5  56.39,8.13 90 top
R6  61.09,8.13 270 top
R7  20.45,18.92 0 top
R8  18.03,17.14 90 top
R9  68.33,22.35 90 top
R10  62.23,22.35 90 top
R11  63.75,22.35 270 top
R14  57.66,22.35 90 top
R15  59.18,22.35 90 top
R16  69.85,22.35 270 top
R17  60.71,22.35 270 top
R18  65.28,22.35 90 top
R19  66.8,22.35 270 top
R20  71.37,8.13 270 top
R21  71.37,16.26 0 top
R22  69.85,8.13 90 top
R23  29.97,9.78 270 top
R25  25.78,7.75 180 top
R26  25.78,9.53 0 top
S1  55.37,22.86 270 top
S2  67.06,2.67 0 top
S3  56.77,2.54 0 top
SJ2  74.17,19.56 270 top
U1  20.45,15.75 180 top
U2  65.41,14.99 180 top
U3  58.17,14.86 180 top
U5  33.27,13.72 270 top
U$1  [_9_RX12]  14.35,27.3 270 top
U$2  29.59,13.34 270 top
U$3  [5_TX11]  24.51,27.05 270 top
U$4  [612]  21.97,26.92 270 top
U$5  [_ESP4]  22.61,26.16 270 top
U$6  [_RST5]  21.21,26.16 270 top
U$7  [7#24V0]  5.71,1.65 90 bottom
U$8  [GRN2]  49.78,9.27 270 top
U$9  [BLK3]  49.78,21.97 270 top
U$10  [_MOSI7]  16.26,4.57 270 top
U$11  [12#1]  20.32,3.81 270 top
U$12  [13#2]  22.86,3.81 270 top
U$13  [RX14]  12.19,23.88 270 top
U$14  [TX15]  8,21.59 270 top
U$15  [GND6]  12.19,19.05 270 top
U$16  [5V7]  8,15.62 270 top
U$17  [00]  57.02,25.02 0 top
U$18  [RST1]  65.02,5.21 0 top
U$19  [MISO8]  19.05,4.45 270 top
U$20  [SCK11]  21.59,3.94 270 top
U$21  [GND10]  5.71,12.83 90 bottom
U$22  [CAN11]  5.71,7.37 90 bottom
U$23  [HI26]  1.78,9.91 90 bottom
U$24  [LO27]  1.65,6.22 90 bottom
U$25  [48518]  5.71,18.16 90 bottom
U$27  [JP23]  48.9,14.35 270 top
U$28  [11#0]  17.53,3.81 270 top
U$29  [A33]  1.65,17.14 90 bottom
U$30  [B34]  1.65,20.7 90 bottom
U$32  [AST_WIFI_SHIELD0]  35.94,8.64 0 bottom
U$33  [SFE_LOGO_NAME_FLAME_.2]  39.24,9.53 0 bottom
U$35  [AST_WIFI_SHIELD0]  78.49,21.46 270 top
U$36  [FTDI7]  49.02,21.97 0 top
U$37  [168]  70.48,19.56 0 top
U$38  [ESP22]  49.78,23.5 0 top
U$39  [RST23]  69.34,17.65 0 top
U$40  [52]  58.29,5.71 0 top
U$41  [RUN1]  51.05,4.83 270 top
U$42  [PROG0]  62.48,5.46 270 top
U$43  [4_CS0]  26.92,26.67 270 top
Y1  65.66,8.13 0 top

### Tracks (layer width: path | path; a pad name or v marks a point on that pad's centre or on a via)
3.3V  (via drill 0.38)
  Top 0.254: U2.29 65.66,11.94 65.91,11.68 | 65.91,11.68 66.54,11.05 v66.54,10.92 | 65.91,11.68 66.16,11.93 U2.30 | U2.11 66.16,18.92 v66.41,19.18 | C13.1 58.72,8.98 | U2.17 62.51,16.74 62.13,17.11 62.13,18.19 v63.12,19.18 | R20.2 v73.11,7.28 | U2.1 68.3,13.24 v69.22,12.32 | 68.61,14.74 68.61,14.38 68.47,14.24 U2.3 | v73.11,15.24 72.22,15.24 | 68.61,14.74 69.11,15.24 72.22,15.24 | U2.4 68.61,14.74 | 58.72,6.1 58.72,8.98 | U3.8 60.07,10.16 59.56,9.65 D3.A 59.56,8.98 58.72,8.98 | R25.2 24.93,7.69 Q5.1 22.79,7.69 v22.61,7.87 | C5.1 69.6,12.7 v69.22,12.32 | C6.1 69.66,11.24 69.22,11.68 v69.22,12.32 | R21.2 72.22,15.24 | R15.2 R14.2 56.6,23.2 v56.26,22.86 | Q1.1 36.32,10.6 R1.2 34.8,8.98 R4.2 34.7,8.7 Q2.1 31.56,8.7 v31.5,8.64
  Top 0.61: v73.11,7.28 73.11,6.69 71.5,5.08 59.44,5.08 58.72,5.8 58.72,6.1 | U5.5 36.32,14.67 C1.1 v37.66,14.57
  Bottom 0.254: v22.61,7.87 30.73,7.87 v31.5,8.64 31.75,8.89 31.75,13.97 32.35,14.57 v37.66,14.57
  Bottom 0.61: 73.11,10.92 v73.11,15.24 73.11,15.76 69.7,19.18 v66.41,19.18 v63.12,19.18 61.59,19.18 61.21,19.56 57.91,22.86 v56.26,22.86 49.02,22.86 47.62,21.46 47.62,15.88 | 73.11,10.92 v73.11,7.28 | v66.54,10.92 69.22,10.92 | 69.22,10.92 73.11,10.92 | 47.62,15.88 46.1,15.88 38.46,15.88 37.66,15.07 v37.66,14.57 | v69.22,12.32 69.22,10.92 | 47.62,15.88 48.9,14.61 J2.4
5V
  Top 0.254: U5.3 32.83,12.77 33.15,13.08 33.15,14.35 32.83,14.67 U5.1 | R23.2 28.32,8.93 28.32,9.14 | R26.2 28.32,9.53 28.32,9.65 | R2.2 41.4,7.87 41.15,7.62 34.67,7.62
  Top 0.559: U5.1 30,14.67 C15.1
  Top 0.61: R7.2 25.4,18.92 25.91,18.41 25.91,15.68 L1.P$2 | J3.1 9.27,13.34 2.67,13.34 1.4,12.06 1.4,2.92 2.16,2.16 27.05,2.16 28.32,3.43 28.32,7.62 | C15.1 29.97,14.74 28.77,14.74 28.32,14.74 | C12.1 26.29,14.74 28.32,14.74 | 28.32,7.62 28.32,9.14 28.32,9.65 28.32,14.74 | U$2.VCC 34.67,7.62 28.32,7.62
  pour Top (no thermals): 25.53,16.89 27.3,16.89 27.3,12.57 25.53,12.57
485A
  Bottom 0.254: U$2.485A 12.57,15.88 11.94,15.24 7.62,15.24 6.99,15.88 6.99,17.78 6.17,18.6 J1.2
485B
  Bottom 0.254: U$2.485B 12.57,18.41 11.94,17.78 8.38,17.78 8,18.16 8,21.21 7.11,22.1 J1.1
ANT
  Top 0.508: JP1.1 E2.FEED
ARD_CS  (via drill 0.38)
  Top 0.254: R10.2 v62.23,24.38
  Bottom 0.254: U$2.4 27.05,21.51 29.92,24.38 v62.23,24.38
ARD_ESP_RST
  Top 0.254: R3.2 27.18,18.38 25.83,19.73 23.07,19.73 U$2.6
ARD_MISO
  Top 0.254: R26.1 24.93,10.16 24.8,10.29 22.34,10.29 21.84,10.29 21.51,9.95 Q5.3 21.51,7.79 21.21,7.49 20.19,7.49 19.43,6.73 U$2.12
ARD_MOSI  (via drill 0.38)
  Top 0.254: R18.2 v65.28,25.53
  Bottom 0.254: v65.28,25.53 65.24,25.57 29.21,25.57 24.8,25.57 23.33,24.09 23.33,19.27 22.35,18.29 20.19,18.29 18.29,16.38 18.29,7.8 16.89,6.4 16.89,5.28 U$2.11
ARD_RX
  Top 0.254: U$2.RXI 38.99,12.06 38.35,11.43 31.29,11.43 | 31.29,11.43 Q2.3 | R23.1 30.77,11.43 31.29,11.43
ARD_SCK  (via drill 0.38)
  Top 0.254: R9.2 v68.33,24.38
  Bottom 0.254: v68.33,24.38 63.82,24.38 63.14,25.06 28.36,25.06 25.78,22.48 25.78,18.29 24,16.51 21.84,16.51 20.19,14.86 20.19,8 21.97,6.22 U$2.13
ARD_TX
  Top 0.254: Q1.3 39.84,10.24 40.09,10.5 R2.1 44.23,10.5 U$2.TXO
CANHI
  Bottom 0.254: U$2.CANHI 7.62,10.79 6.82,11.6 J1.4
CANLO
  Bottom 0.254: U$2.CANLO 12.73,8.26 12.57,8.1 J1.5
CHIP_EN
  Top 0.254: R21.1 70.52,16.24 U2.7
DTR
  Top 0.254: C4.2 47.37,9.53 | 47.37,9.53 47.37,7.62 48.01,6.99 J2.1 | JP2.1 47.37,9.53
ESP_CS
  Top 0.254: U2.13 65.16,17.78 65.16,18.28 65.16,20.06 64.83,20.38 63.75,21.46 R11.2 62.99,21.5 62.48,21.5 R10.1 R17.2
ESP_MISO  (via drill 0.38)
  Top 0.254: U2.10 66.66,17.78 66.66,18.31 67.08,18.74 v67.08,20.19 | R25.1 26.63,8.42 26.42,8.64 23.88,8.64 23.61,8.91 Q5.2 22.66,9.59 v22.6,9.53
  Bottom 0.254: v67.08,20.19 61.72,20.19 58.38,23.53 32.68,23.53 30.86,21.72 30.86,11.3 29.08,9.53 v22.6,9.53
ESP_MOSI
  Top 0.254: R19.2 66.04,21.5 | U2.12 65.66,19.43 66.04,19.81 66.04,21.5 | R18.1 66.04,21.5
ESP_RST  (via drill 0.38)
  Top 0.254: U2.32 67.16,12.09 67.44,11.81 v67.82,11.81 68.33,11.81 69.77,10.37 70.91,10.37 71.37,9.91 R20.1 | S2.4 S2.3 69.76,3.47 v70.23,3.94 | 47.37,22.61 48.39,22.61 v49.53,21.46 | Q6.3 30.86,19.68 30.86,21.59 31.88,22.61 46.74,22.61 46.86,22.61 47.37,22.61 | C4.1 47.37,22.61
  Bottom 0.254: SJ2.2 75.18,16 75.18,6.48 74.8,6.1 70.41,6.1 | 70.41,6.1 70.41,4.12 v70.23,3.94 | 70.41,6.1 70.41,9.09 69.76,9.74 66.33,9.74 65.87,10.2 65.87,11.39 66.33,11.85 67.78,11.85 v67.82,11.81 67.82,17.14 66.89,18.07 60.16,18.07 56.77,21.46 v49.53,21.46
ESP_RX  (via drill 0.38)
  Top 0.254: v62.23,12.44 62.8,11.86 63.42,11.86 63.66,12.09 U2.25 | S3.5 55.82,3.74 55.5,4.06 v55.5,5.33
  Bottom 0.254: v62.23,12.44 61.59,12.44 60.58,11.43 60.58,9.65 59.87,8.94 58.24,8.94 57.61,9.58 56.39,10.79 53.59,10.79 52.32,12.06 J2.3 50.8,12.06 50.16,11.43 50.16,5.97 50.8,5.33 v55.5,5.33
ESP_RX_SW  (via drill 0.38)
  Top 0.254: R1.1 36.42,8.7 Q1.2 38.55,8.7 38.73,8.89 v38.73,9.65 | v52.96,3.81 53.03,3.74 S3.6
  Bottom 0.254: v52.96,3.81 49.53,3.81 48.13,5.21 48.13,7.24 47.12,8.26 40.13,8.26 v38.73,9.65
ESP_SCK
  Top 0.254: R16.2 69.09,21.5 R9.1 68.33,20.34 68.33,19.08 67.16,17.91 U2.9
ESP_TX  (via drill 0.38)
  Top 0.254: v61.98,11.05 63.25,11.05 64.16,11.96 U2.26 | S3.2 57.73,1.34 58.04,1.65 v58.04,4.83
  Bottom 0.254: v61.98,11.05 61.98,8.64 60.83,7.49 59.18,7.49 | 59.18,7.49 57.91,7.49 57.02,8.38 55.88,9.53 J2.2 | v58.04,4.83 58.8,4.83 59.18,5.21 59.18,7.49
ESP_TX_SW  (via drill 0.38)
  Top 0.254: R4.1 34.7,10.6 Q2.2 32.74,10.6 32.42,10.29 v32.42,9.65 | v52.96,1.4 53.02,1.34 S3.1
  Bottom 0.254: v52.96,1.4 35.94,1.4 33.4,3.94 33.4,8.67 v32.42,9.65
GND  (via drill 0.38)
  Top 0.508: E1.GND2 77.27,18.62 v76.83,19.05 | E1.GND 76.92,16.42 v76.83,16.51
  other vias: 65.41,14.99 64.26,16.13 65.41,16.13 66.55,16.13 64.26,14.99 66.55,14.99 64.26,13.84 65.41,13.84 66.55,13.84 57.15,15.75 62.87,10.29 57.78,5.97 65.66,8.13 65.66,6.1 67.56,5.97 69.22,6.1 24.38,11.43 21.08,11.18 74.17,13.21 74.17,11.56 76.83,24.13 76.83,21.59 76.83,12.19 76.83,7.11 76.83,3.81 76.83,1.27 29.21,3.17 76.83,25.91 75.82,25.02 75.95,22.86 75.95,20.32 76.2,17.78 76.83,13.97 74.17,15.11 75.69,5.46 76.2,2.54 25.4,23.24 27.05,22.61 16.89,14.61
  pour Top (rank 2): 0,0 77.47,0 77.47,26.67 0,26.67
  pour Bottom (rank 2): 0,0 77.47,0 77.47,26.67 0,26.67
GPIO0
  Top 0.254: R14.1 57.66,19.96 | U2.15 64.16,19.33 63.52,19.96 57.66,19.96 | S1.4 56.17,23.79 55.59,23.2 55.59,22.44 | 55.59,22.44 56.17,21.86 S1.3 56.17,20.16 56.36,19.96 57.66,19.96 | D2.A 48.9,19.3 52.03,22.44 55.59,22.44
GPIO2
  Top 0.254: R15.1 59.18,20.7 59.36,20.52 63.8,20.52 64.66,19.67 U2.14
GPIO5
  Top 0.254: U2.24 61.75,13.24 61.09,12.57 R6.1
GPIO16
  Top 0.254: U2.8 69.19,16.74 69.57,17.12 69.57,18.51 70.61,19.56 SJ2.1
N$1
  Top 0.61: C9.1 21.72,17.91 21.4,17.59 U1.1
N$2
  Top 0.254: D2.C JP2.2
N$3
  Top 0.254: U2.31 66.66,11.83 67.44,11.05 68.45,11.05 69.85,9.65 R22.2
N$4
  Top 0.254: C10.2 66.83,8.98 Y1.3 66.83,9.75 66.33,10.25 65.57,10.25 65.16,10.66 U2.28
N$5
  Top 0.254: Y1.1 64.48,7.28 63.5,7.28 | U2.27 64.66,12.54 64.66,11.06 63.5,9.91 63.5,8.12 63.5,7.28 | 63.5,7.28 C8.2
N$6
  Top 0.254: U2.2 68.98,13.74 69.47,14.22 C2.1
N$7
  Top 0.254: C2.2 JP1.2
N$8
  Top 0.203: 19.5,18.41 19.5,18.92 R7.1
  Top 0.254: 19.5,18.41 19.5,18.03 18.03,18.03 R8.2 | 19.5,18.41 | 19.5,18.41 U1.3
N$9
  Top 0.254: D3.C 59.59,7.28 R6.2
N$10
  Top 0.254: Q6.1 28.45,16.65 R3.1
RXI1
  Top 0.254: J3.4 14.1,21.59 U$2.9
SD_!HD!  (via drill 0.38)
  Top 0.254: U3.7 v58.8,10.29 | U2.18 61.8,16.24 v61.51,16.54
  Bottom 0.254: v61.51,16.54 61.51,14.01 60.33,12.83 59.44,12.83 58.8,12.19 v58.8,10.29
SD_!WP!
  Top 0.254: U3.3 57.53,18.8 57.78,19.05 60.45,19.05 60.83,18.67 60.83,16.26 61.35,15.74 U2.19
SD_CLK
  Top 0.254: U3.6 57.53,10.79 57.28,10.54 56.64,10.54 56.39,10.29 R5.2
SD_CLK0  (via drill 0.38)
  Top 0.254: U2.21 59.99,14.74 v59.82,14.91 | v56.13,14.86 55.5,14.22 55.5,12.7 55.5,7.49 55.71,7.28 R5.1
  Bottom 0.254: v59.82,14.91 56.18,14.91 v56.13,14.86
SD_CS0
  Top 0.254: U2.20 60.84,15.24 60.07,16 U3.1
SD_SI
  Top 0.254: U2.23 56.53,13.74 56.26,13.46 U3.5
SD_SO
  Top 0.254: U3.2 58.8,14.61 59.17,14.24 U2.22
TRACE_ANT
  Top 0.508: JP1.3 76.12,15.04 76.33,15.24 E1.ANT
TXO1
  Top 0.254: U$2.5 24.51,22.61 23.75,23.37 8.64,23.37 8,22.73 8,19.56 8.51,19.05 J3.3
VIN
  Top 0.61: J1.6 10.19,4.6 11.94,6.35 11.94,11.3 12.7,12.06 18,12.06 C3.1
  pour Top (no thermals): 18.92,11.3 17.27,11.3 17.27,13.08 19.3,15.11 20.7,15.11 20.7,12.06 19.94,11.3
VSW
  pour Top (no thermals): 21.21,14.61 21.21,14.99 21.34,15.11 22.61,16.51 22.99,16.89 23.62,16.89 24,17.27 24,18.29 25.02,18.29 25.02,13.34 24.13,12.45 21.21,12.45

### Text on the board
Bottom: v10
Measures: Units: Inches
tDocu: C. Malan | Revised by: Alex Wende